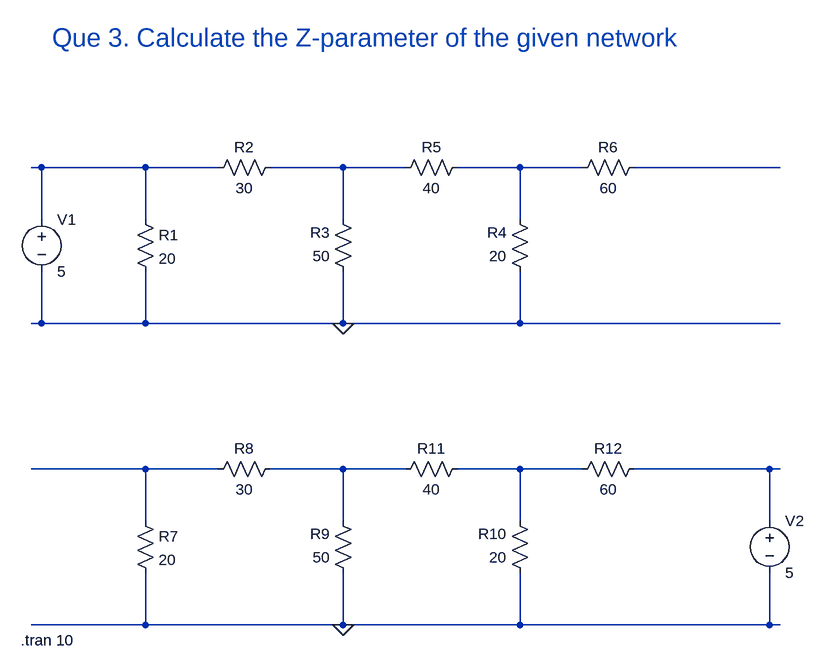
[diagram p0: schematic 3_Dheerendra_23EE019_AC_Two_Port.asc]
3_Dheerendra_23EE019_AC_Two_Port.asc, the LTspice schematic file:
Version 4
SHEET 1 1128 840
WIRE -48 96 -64 96
WIRE 112 96 -48 96
WIRE 224 96 112 96
WIRE 416 96 304 96
WIRE 512 96 416 96
WIRE 688 96 592 96
WIRE 784 96 688 96
WIRE 1088 96 864 96
WIRE -48 176 -48 96
WIRE 112 176 112 96
WIRE 416 176 416 96
WIRE 688 176 688 96
WIRE -48 336 -48 256
WIRE -48 336 -64 336
WIRE 112 336 112 256
WIRE 112 336 -48 336
WIRE 416 336 416 256
WIRE 416 336 112 336
WIRE 688 336 688 256
WIRE 688 336 416 336
WIRE 1088 336 688 336
WIRE 112 560 -64 560
WIRE 224 560 112 560
WIRE 416 560 304 560
WIRE 512 560 416 560
WIRE 688 560 592 560
WIRE 784 560 688 560
WIRE 1072 560 864 560
WIRE 1088 560 1072 560
WIRE 112 640 112 560
WIRE 416 640 416 560
WIRE 688 640 688 560
WIRE 1072 640 1072 560
WIRE 112 800 112 720
WIRE 112 800 -64 800
WIRE 416 800 416 720
WIRE 416 800 112 800
WIRE 688 800 688 720
WIRE 688 800 416 800
WIRE 1072 800 1072 720
WIRE 1072 800 688 800
WIRE 1088 800 1072 800
FLAG 416 336 0
FLAG 416 800 0
SYMBOL res 96 160 R0
SYMATTR InstName R1
SYMATTR Value 20
SYMBOL res 320 80 R90
WINDOW 0 0 56 VBottom 2
WINDOW 3 32 56 VTop 2
SYMATTR InstName R2
SYMATTR Value 30
SYMBOL res 432 272 R180
WINDOW 0 36 76 Left 2
WINDOW 3 36 40 Left 2
SYMATTR InstName R3
SYMATTR Value 50
SYMBOL res 704 272 R180
WINDOW 0 36 76 Left 2
WINDOW 3 36 40 Left 2
SYMATTR InstName R4
SYMATTR Value 20
SYMBOL res 608 80 R90
WINDOW 0 0 56 VBottom 2
WINDOW 3 32 56 VTop 2
SYMATTR InstName R5
SYMATTR Value 40
SYMBOL res 880 80 R90
WINDOW 0 0 56 VBottom 2
WINDOW 3 32 56 VTop 2
SYMATTR InstName R6
SYMATTR Value 60
SYMBOL res 96 624 R0
SYMATTR InstName R7
SYMATTR Value 20
SYMBOL res 320 544 R90
WINDOW 0 0 56 VBottom 2
WINDOW 3 32 56 VTop 2
SYMATTR InstName R8
SYMATTR Value 30
SYMBOL res 432 736 R180
WINDOW 0 36 76 Left 2
WINDOW 3 36 40 Left 2
SYMATTR InstName R9
SYMATTR Value 50
SYMBOL res 704 736 R180
WINDOW 0 36 76 Left 2
WINDOW 3 36 40 Left 2
SYMATTR InstName R10
SYMATTR Value 20
SYMBOL res 608 544 R90
WINDOW 0 0 56 VBottom 2
WINDOW 3 32 56 VTop 2
SYMATTR InstName R11
SYMATTR Value 40
SYMBOL res 880 544 R90
WINDOW 0 0 56 VBottom 2
WINDOW 3 32 56 VTop 2
SYMATTR InstName R12
SYMATTR Value 60
SYMBOL voltage -48 160 R0
WINDOW 123 0 0 Left 0
WINDOW 39 0 0 Left 0
SYMATTR InstName V1
SYMATTR Value 5
SYMBOL voltage 1072 624 R0
WINDOW 123 0 0 Left 0
WINDOW 39 0 0 Left 0
SYMATTR InstName V2
SYMATTR Value 5
TEXT -32 -104 Left 4 ;Que 3. Calculate the Z-parameter of the given network
TEXT -80 824 Left 2 !.tran 10

The netlist it stands for:
* 3_Dheerendra_23EE019_AC_Two_Port.asc
R1 N001 0 20
R2 N002 N001 30
R3 0 N002 50
R4 0 N003 20
R5 N003 N002 40
R6 N004 N003 60
R7 N005 0 20
R8 N006 N005 30
R9 0 N006 50
R10 0 N007 20
R11 N007 N006 40
R12 N008 N007 60
V1 N001 0 5
V2 N008 0 5
* Que 3. Calculate the Z-parameter of the given network
.tran 10
.backanno
.end